# Altium schematic sheet ife19_TS_Charger.SchDoc
size A4
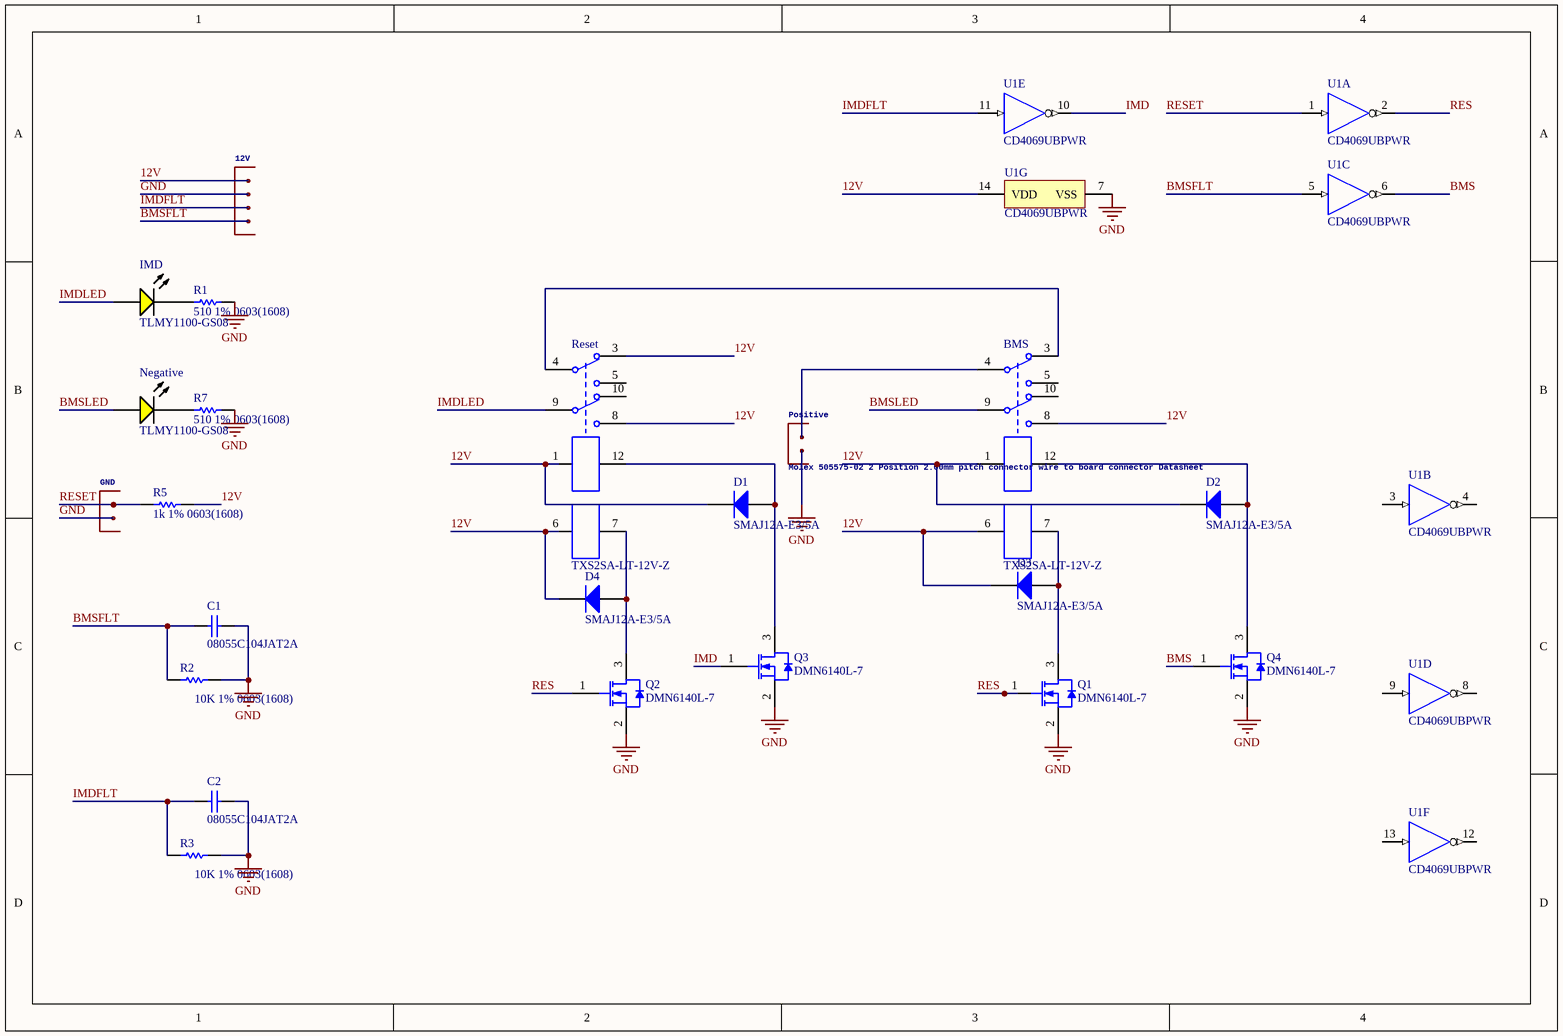
[diagram p0: ife19_TS_Charger.SchDoc]

## Parts
12V  Molex 505575-04 4 Position 2.00mm pitch connector wire to board connector Datasheet  [505575-04]  (value not drawn)
BMS  TXS2SA-LT-12V-Z  [PNSC-TXS2SA-L2_V]
C1  08055C104JAT2A  [CAPC2013X94X50LL20T25]
C2  08055C104JAT2A  [CAPC2013X94X50LL20T25]
D1  SMAJ12A-E3/5A  [VISH-DO-214AC-2_M]
D2  SMAJ12A-E3/5A  [VISH-DO-214AC-2_M]
D3  SMAJ12A-E3/5A  [VISH-DO-214AC-2_M]
D4  SMAJ12A-E3/5A  [VISH-DO-214AC-2_M]
GND  Molex 505575-02 2 Position 2.00mm pitch connector wire to board connector Datasheet  [505575-02]  (value not drawn)
IMD  TLMY1100-GS08  [VISH-TLMX1100-2_V]
Negative  TLMY1100-GS08  [VISH-TLMX1100-2_V]
Positive  Molex 505575-02 2 Position 2.00mm pitch connector wire to board connector Datasheet  [505575-02]
Q1  DMN6140L-7  [FAIR-SOT23-3_V]
Q2  DMN6140L-7  [FAIR-SOT23-3_V]
Q3  DMN6140L-7  [FAIR-SOT23-3_V]
Q4  DMN6140L-7  [FAIR-SOT23-3_V]
R1  510 1% 0603(1608)  [RESC0603(1608)_L]
R2  10K 1% 0603(1608)  [RESC0603(1608)_L]
R3  10K 1% 0603(1608)  [RESC0603(1608)_L]
R5  1k 1% 0603(1608)  [RESC0603(1608)_L]
R7  510 1% 0603(1608)  [RESC0603(1608)_L]
Reset  TXS2SA-LT-12V-Z  [PNSC-TXS2SA-L2_V]
U1  CD4069UBPWR  [PW0014A_N]  (parts A,B,C,D,E,F,G of 7)

## Nets
GND: 12V.2 C1.2 C2.2 GND.2 Positive.2 Q1.2(S) Q2.2(S) Q3.2(S) Q4.2(S) R1.1 R2.1 R3.1 R7.1 U1.7(VSS)
12V: 12V.1 BMS.1 BMS.6 BMS.8 D1.1(K) D2.1(K) D3.1(K) D4.1(K) R5.1 Reset.1 Reset.3 Reset.6 Reset.8 U1.14(VDD)
BMS: Q4.1(G) U1.6(I=~{C})
BMSFLT: 12V.4 C1.1 R2.2 U1.5(C)
BMSLED: BMS.9 Negative.1(A)
IMD: Q3.1(G) U1.10(K=~{E})
IMDFLT: 12V.3 C2.1 R3.2 U1.11(E)
IMDLED: IMD.1(A) Reset.9
RES: Q1.1(G) Q2.1(G) U1.2(G=~{A})
RESET: GND.1 R5.2 U1.1(A)
NetBMS_3: BMS.3 Reset.4
NetBMS_4: BMS.4 Positive.1
NetBMS_7: BMS.7 D3.2(A) Q1.3(D)
NetBMS_12: BMS.12 D2.2(A) Q4.3(D)
NetD1_2: D1.2(A) Q3.3(D) Reset.12
NetD4_2: D4.2(A) Q2.3(D) Reset.7
NetIMD_2: IMD.2(K) R1.2
NetNegative_2: Negative.2(K) R7.2

Not connected (* = marked no-connect by the designer): BMS 5 10; Reset 5 10; U1 3(B) 4(H=~{B}) 8(J=~{D}) 9(D) 12(L=~{F}) 13(F)

## Library data of the parts
12V = 505575-04: GateName_1: G$1; SymbolName_1: 4POS; LibraryName: MOLEX Micro-Lock; DeviceSetName: 505575-04; Package: 505575-04
BMS Reset = CMP-2000-07338-1: Very High Sensitivity, Relay, 70 mW, 3 V, 10-Pin SMD, RoHS, Tape and Reel; Manufacturer: Panasonic; Operate Time: 5ms; Switching Voltage: 110VDC-Max; Contact Rating (Current): 1A; Turn On Voltage (Max): 2.4VDC; Other Names: 255-2347-2 / TXS2SA-L2-3V-Z-ND; Coil Resistance: 129Ohms; Coil Power: 70mW; Relay Type: GeneralPurpose; Dynamic Catalog: TX-SSeries; Coil Type: Latching,DualCoil; Contact Form: DPDT(2FormC); Coil Voltage: 3VDC; Catalog Drawings: TX,TXSSeriesSMD / TX,TXSSeriesCircuitL2; Other Related Documents: RelayTechnicalInfo / StandardsChart / HowtoReadDateCodes; Coil Current: 23.3mA; Features: Sealed-Fully; Category: Relays; Mounting Type: SurfaceMount; Family: SignalRelays,Upto2Amps; Release Time: 5ms; Contact Material: Silver(Ag),Gold(Au); Operating Temperature: -40°C~70°C; Datasheet Version: 02/2014; Mounting Technology: SurfaceMount; Manufacturer URL: http://www.panasonic.com/; Standard Package: 500; Datasheet URL: http://www.panasonic-electric-works.com/eu-asset/en/downloads/ds_61022_en_txs.pdf; Series: TX-S; Packaging: Tape&Reel(TR); Termination Style: GullWing; Package Description: 10-Pin Surface Mount Device, Body 15 x 7.4 mm, Pitch 2.54 mm; Package Reference: TXS2SA-L2
C1 C2 = CMP-2000-05808-1: Chip Capacitor, 0.1 uF, +/- 5%, 50 V, -55 to 125 degC, 0805 (2012 Metric), RoHS, Tape and Reel; Case Width: 1.25mm; Case Length: 2.01mm; Case Height: 0.94mm; Capacitance: 0.1uF; Brand: AVX; Type: StandardX7RMLCCs; Capacitance - nF: 100nF; Dissipation Factor DF: 2.5; Voltage Rating DC: 50V; Temperature Coefficient / Code: +/-15%; Capacitance - pF: 100000pF; Dielectric: X7R; Dimensions: 1.25mmWx2.01mmLx0.94mmH; Product: GeneralTypeMLCCs; Package Description: 2-Pin Surface Mount Device, Body 2.01 x 1.25 mm; Package / Case: 0805(2012metric); Product Category: MultilayerCeramicCapacitorsMLCC-SMD/SMT; Case Code - mm: 2012; Packaging: Reel; Manufacturer URL: http://www.avx.com/; Operating Temperature Range: -55Cto+125C; Termination Style: SMD/SMT; Maximum Operating Temperature: +125C; Case Code - in: 0805; Minimum Operating Temperature: -55C; Factory Pack Quantity: 4000; RoHS: Details; Voltage Rating: 50V; Tolerance: 5%; Package Reference: 0805; Datasheet URL: http://www.farnell.com/datasheets/1679506.pdf; Manufacturer: AVX; Mounting Technology: SurfaceMount; Datasheet Version: 11/2012
D1-D4 = CMP-0548-00315-2: Transient Voltage Suppressor, 6.40 to 231 V, 12 V Stand-off Voltage, Uni-Directional, -55 to 155 degC, 2-pin DO-214AC, Pb-Free, Tape and Reel; Manufacturer: Vishay Semiconductor; IFSM: 40 A; ID (uA): 1; VBR Uni-Directional (V): 6.4 to 231; PPPM (W): 400, 300; VWM (V): 12; PartNumber: SMAJ12A-E3/5A; ComponentLink2URL: http://www.vishay.com/docs/88390/smaj50a.pdf; Packing: Tape and Reel; DatasheetVersion: 12/8/2013; Operating Junction and Storage Temperature Range: -55 to 150 degC; Mounting Technology: Surface Mount; PackageDescription: 2-Pin DO-214AC (SMA), Body 4.245 x 2.665 mm; ComponentLink1URL: http://www.vishay.com/; ComponentLink3Description: Package Specification; PackageReference: DO-214AC-2; ComponentLink1Description: Manufacturer URL; ComponentLink2Description: Datasheet; RoHS: TRUE; ComponentLink3URL: http://www.vishay.com/docs/88390/smaj50a.pdf
GND Positive = 505575-02: GateName_1: G$1; SymbolName_1: 2POS; LibraryName: MOLEX Micro-Lock; DeviceSetName: 505575-02; Package: 505575-02
IMD Negative = CMP-1666-00030-1: Yellow LED, 20 mA, 2.1 V, -40 to 100 degC, 2-Pin SMD (0603), RoHS, Tape and Reel; ComponentLink2Description: Datasheet; ComponentLink2URL: http://download.siliconexpert.com/pdfs/2016/8/7/12/43/26/667/vsh_/manual/379263299541529tlmb1100.pdf; ComponentLink1Description: Manufacturer URL; PackageDescription: 2-Pin Surface Mount Device, Body 1.6 x 0.8 mm; DatasheetVersion: Rev. 2.7, 03/2016; ComponentLink1URL: http://www.vishay.com/; PackageReference: 0603
Q1-Q4 = CMP-1670-00009-1: N-Channel Logic Level Enhancement Mode Field Effect Transistor, 220 mA, 50 V, -55 to 150 degC, 3-Pin SOT-23, RoHS, Tape and Reel; ESR: 40 Ohm; Tolerance: 30ppm; Capacitance: 1.8E-11 f; Load Capacitance: 18 pF; Frequency: 12 MHz; Resistance: 100 Ohm; Min Operating Temperature: -20degC; ComponentLink2URL: https://www.fairchildsemi.com/datasheets/BS/BSS138.pdf; Max Operating Temperature: 70degC; Width: 0.126 inch; Pins: 4; Length: 0.197 inch; ComponentLink2Description: Datasheet; Package Quantity: 1; PackageReference: SOT23-3; Packaging: Tape and Reel; RoHSCompliant: True; Frequency Tolerance: 30ppm; ComponentLink3Description: Package Specification; Mount: Surface Mount; REACH SVHC: Unknown; Height: 0.041 inch; ComponentLink1URL: https://www.fairchildsemi.com/; PackageDescription: 3-Pin Small Outline Transistor, Body 2.92 x 1.325 mm, Pitch 0.95 mm; ComponentLink3URL: http://www.fairchildsemi.com/dwg/MA/MA03D.pdf; ComponentLink1Description: Manufacturer URL; DatasheetVersion: Rev. C, 10/2005
R1-R3 R5 R7 = CMP-1012-00779-1: 249K 0.1W 1% 0603 (1608 Metric)  SMD; Case-Metric: 1608; Case-EIA: 0603; Value: 249000.00 Ohm; Technology: SMT; Power: 0.1 W; Tolerance: 1 %
U1 = CMP-1615-00092-1: CMOS Hex Inverter, PW0014A, LARGE T&R; Manufacturer: Texas Instruments; Output Drive (IOL/IOH)(Max)(mA): -1/1; tpd @ Nom Voltage(Max)(ns): 110; Rating: Catalog; ICC @ Nom Voltage(Max)(mA): 0.0075; Technology Family: CD4000; VCC(Max)(V): 18; Voltage(Nom)(V): 5; Schmitt Trigger: No; F @ Nom Voltage(Max)(Mhz): 12; VCC(Min)(V): 3; Bits(#): 6; ComponentLink2URL: http://www.ti.com/lit/ds/symlink/cd4069ub.pdf; ComponentLink3Description: Package Specification; ComponentLink1Description: Manufacturer URL; ComponentLink1URL: http://www.ti.com/; DatasheetVersion: SCHS054C; Input Type: CMOS; Output Type: CMOS; Operating Temperature Range(C): -55 to 125; Code_JEDEC: MO-153; ComponentLink3URL: http://www.ti.com/lit/ml/mpds360/mpds360.pdf; PackageReference: PW0014A; PartNumber: CD4069UBPWR; ComponentLink2Description: Datasheet; Generic Part Number: CD4069UB; PartId: 1